# Altium schematic sheet DEVICES.SchDoc: FPGA, LEDs and SRAM Memory
size A4; Organization: Altium Limited.; Address1: Level 3, 12a Rodborough Rd; Address2: Frenchs Forest 2086; Address3: NSW; Address4: AUSTRALIA; DocumentNumber: 2; SheetNumber: 3; SheetTotal: 23
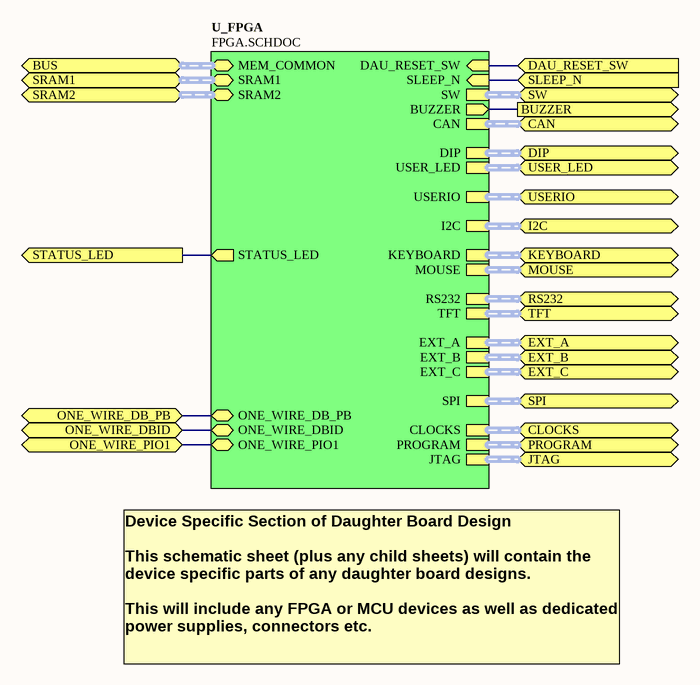
[diagram p0: DEVICES.SchDoc]

## Sub-sheets
U_FPGA = FPGA.SCHDOC: SRAM1 (harness SRAM-256Kx16), SRAM2 (harness SRAM-256Kx16), MEM_COMMON (harness HOSTMEMORY), DAU_RESET_SW (in), BUZZER (out), ONE_WIRE_DBID (bidir), ONE_WIRE_DB_PB (bidir), ONE_WIRE_PIO1 (bidir), JTAG (harness HardSoft_JTAG), SW (harness SW5), DIP (harness SW8), USERIO (harness IO36), EXT_A (harness PBIO), EXT_B (harness PBIO), EXT_C (harness PBIO), USER_LED (harness LED8), SPI (harness DAU_SPI), I2C (harness I2C), CAN (harness CAN_INT), RS232 (harness RS232_INT), KEYBOARD (harness PS2), MOUSE (harness PS2), TFT (harness DAU_TFT), PROGRAM (harness DAU_CTRL), CLOCKS (harness DAU_CLK), STATUS_LED (out), SLEEP_N (in)

## Ports
BUS (harness HOSTMEMORY), BUZZER (out), CAN, CLOCKS, DAU_RESET_SW (in), DIP, EXT_A, EXT_B, EXT_C, I2C, JTAG, KEYBOARD, MOUSE, ONE_WIRE_DB_PB (bidir), ONE_WIRE_DBID (bidir), ONE_WIRE_PIO1 (bidir), PROGRAM, RS232, SLEEP_N (in), SPI, SRAM1, SRAM2 (harness SRAM-256Kx16), STATUS_LED (out), SW, TFT, USER_LED, USERIO

## Nets
BUZZER: port BUZZER, sheet U_FPGA/BUZZER
DAU_RESET_SW: port DAU_RESET_SW, sheet U_FPGA/DAU_RESET_SW
ONE_WIRE_DB_PB: port ONE_WIRE_DB_PB, sheet U_FPGA/ONE_WIRE_DB_PB
ONE_WIRE_DBID: port ONE_WIRE_DBID, sheet U_FPGA/ONE_WIRE_DBID
ONE_WIRE_PIO1: port ONE_WIRE_PIO1, sheet U_FPGA/ONE_WIRE_PIO1
SLEEP_N: port SLEEP_N, sheet U_FPGA/SLEEP_N
STATUS_LED: port STATUS_LED, sheet U_FPGA/STATUS_LED

## Buses and harness runs
harness port BUS = sheet U_FPGA/MEM_COMMON
harness port CAN = sheet U_FPGA/CAN
harness port CLOCKS = sheet U_FPGA/CLOCKS
harness port DIP = sheet U_FPGA/DIP
harness port EXT_A = sheet U_FPGA/EXT_A
harness port EXT_B = sheet U_FPGA/EXT_B
harness port EXT_C = sheet U_FPGA/EXT_C
harness port I2C = sheet U_FPGA/I2C
harness port JTAG = sheet U_FPGA/JTAG
harness port KEYBOARD = sheet U_FPGA/KEYBOARD
harness port MOUSE = sheet U_FPGA/MOUSE
harness port PROGRAM = sheet U_FPGA/PROGRAM
harness port RS232 = sheet U_FPGA/RS232
harness port SPI = sheet U_FPGA/SPI
harness port SRAM1 = sheet U_FPGA/SRAM1
harness port SRAM2 = sheet U_FPGA/SRAM2
harness port SW = sheet U_FPGA/SW
harness port TFT = sheet U_FPGA/TFT
harness port USER_LED = sheet U_FPGA/USER_LED
harness port USERIO = sheet U_FPGA/USERIO

## Notes on the sheet
- Device Specific Section of Daughter Board Design
  This schematic sheet (plus any child sheets) will contain the device specific parts of any daughter board designs.
  This will include any FPGA or MCU devices as well as dedicated power supplies, connectors etc.
- Sheet Title
- Project Title
- Size:
- Date:
- A4
- Assy:
- Time:
- Revision:
- Sheet
- of
- File: